# Altium schematic sheet Схема принципиальная3.SchDoc
size 594 x 420 mm; Address1: Address1; Address2: Address2; Address3: Address3; Address4: Address4; SheetNumber: 1; Scale: 1:1; Разраб.: Павловская В.А.; Пров.: Смолин В.А.; Номер листа: 1; Общее количество листов: 1; Наименование изделия 1: Цифровой автомат; Наименование изделия 2: Схема электрическая; Наименование изделия 3: принципиальная; Нач. отд.: Нач. отд.
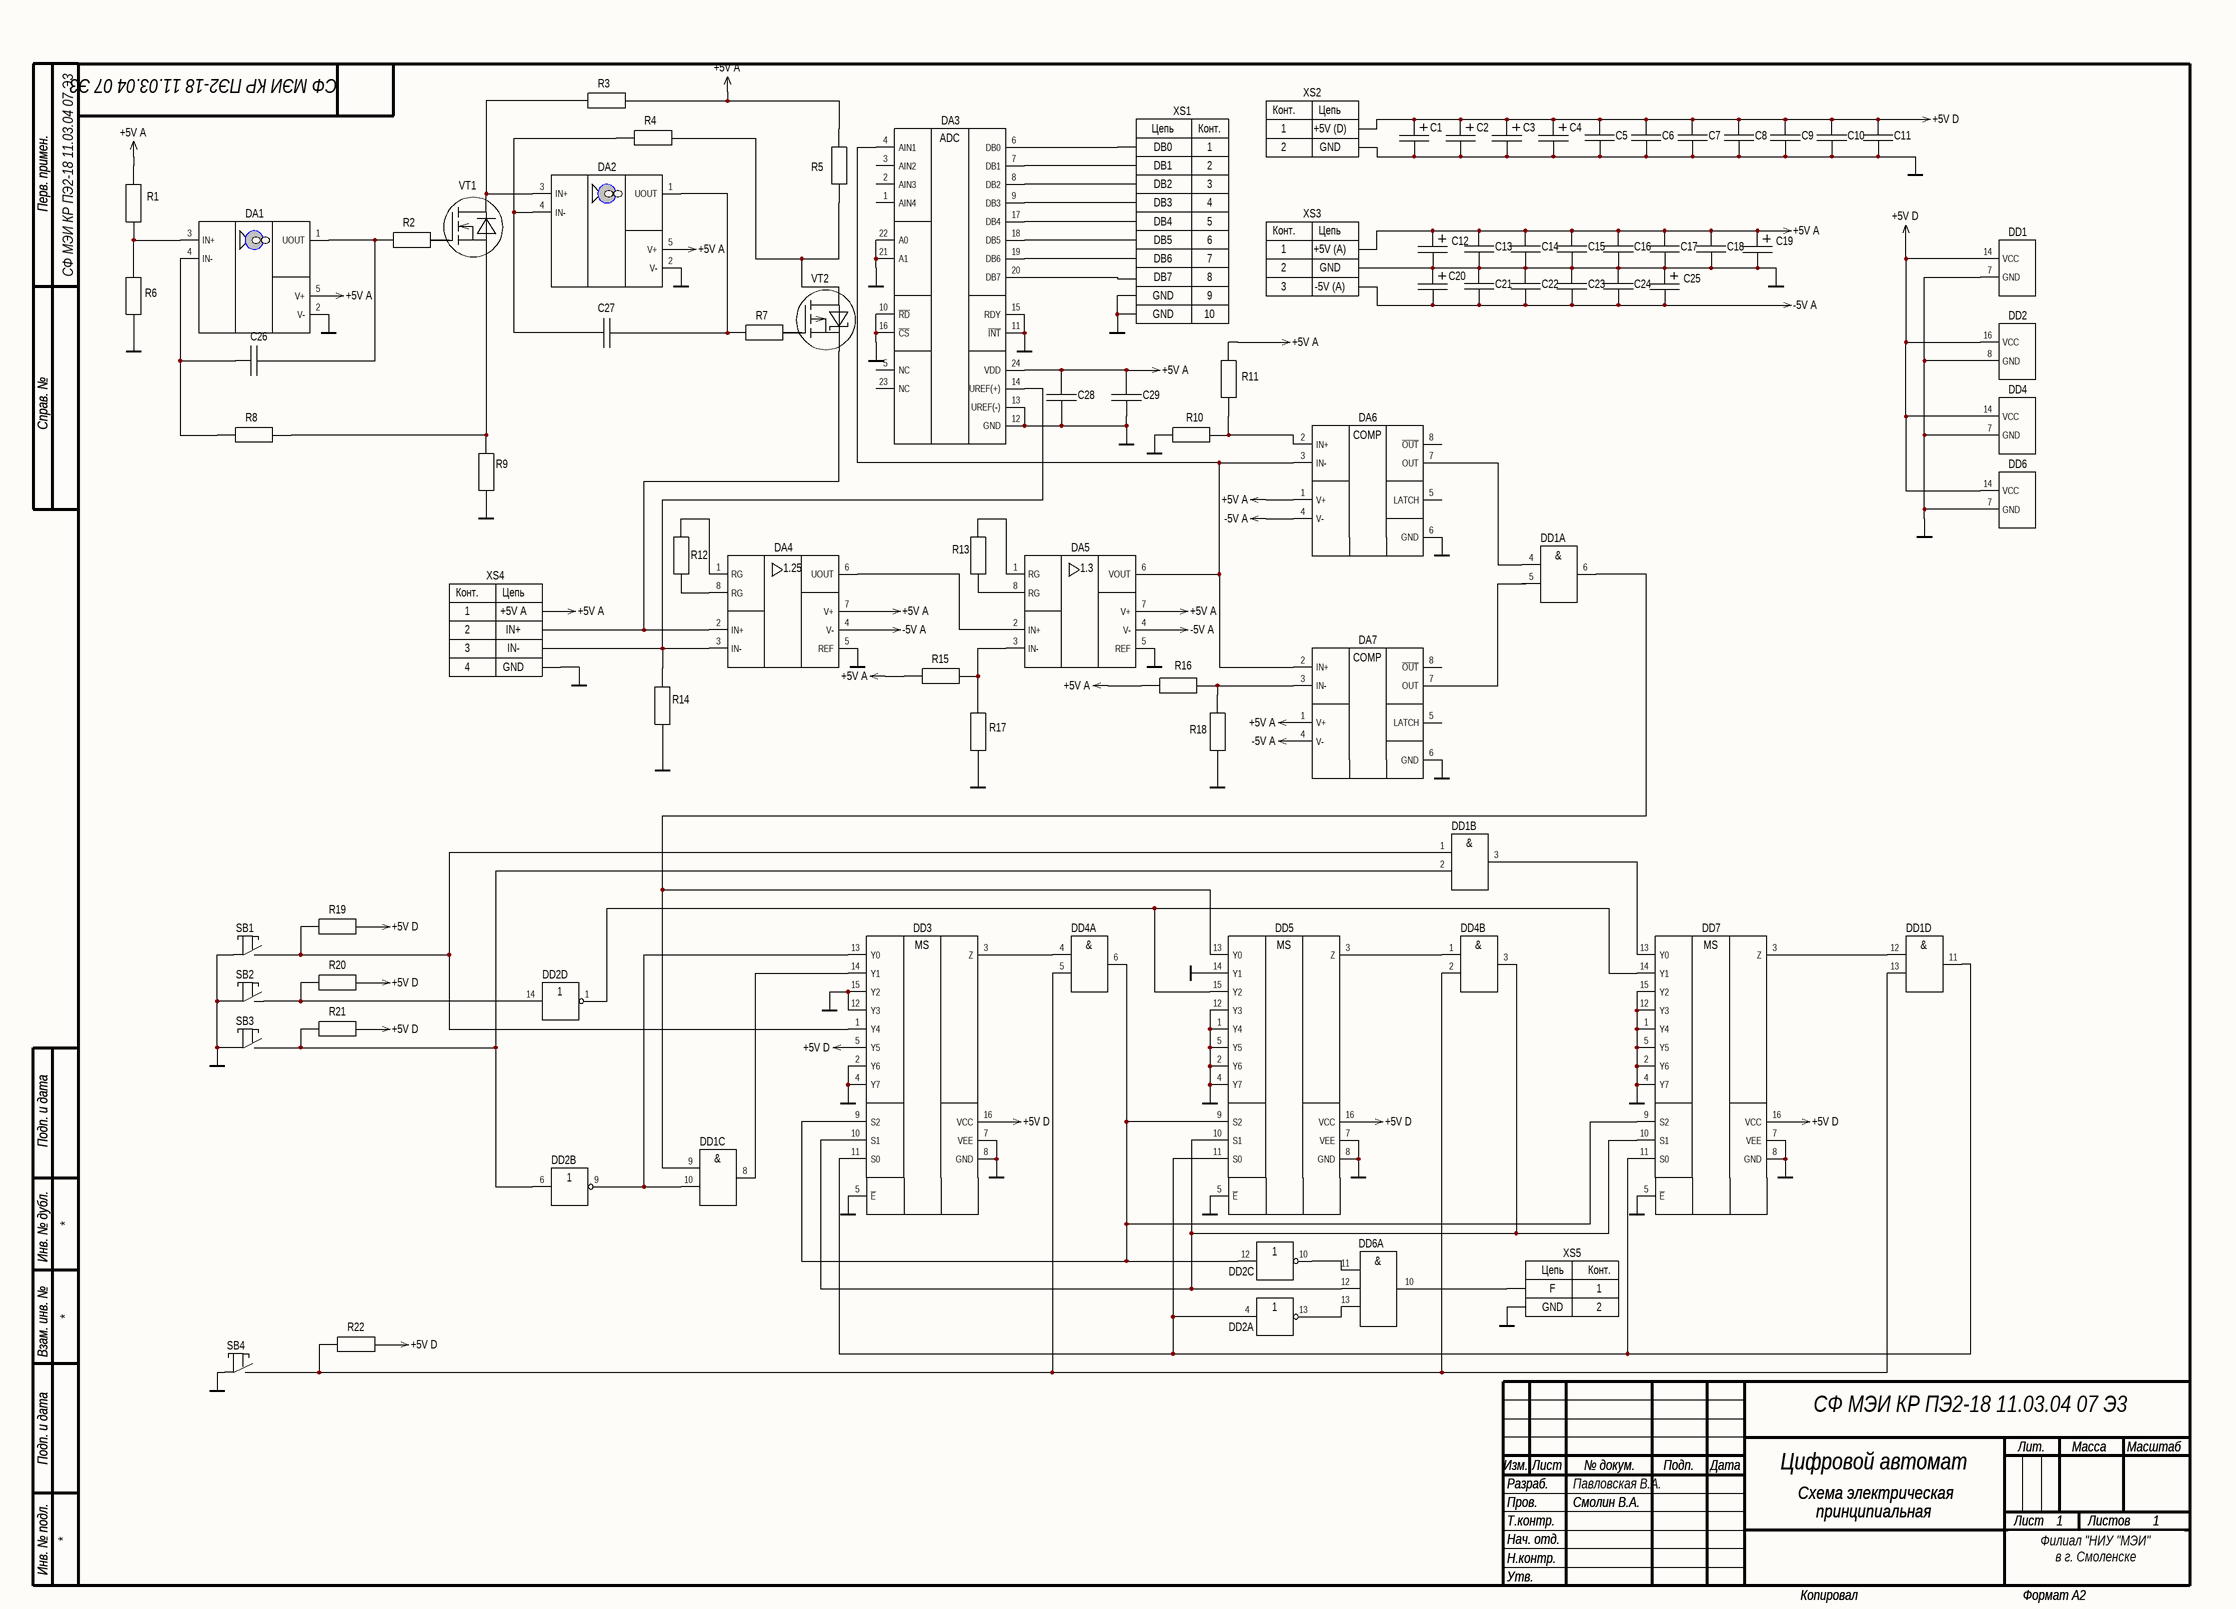
[diagram p0: Схема принципиальная3.SchDoc]

## Parts
C5  0.1uF  [Кер.ЧИП конд. 0.1 мкФ X7R 50В 10% 0805]  (value not drawn)
C6  0.1uF  [Кер.ЧИП конд. 0.1 мкФ X7R 50В 10% 0805]  (value not drawn)
C7  0.1uF  [Кер.ЧИП конд. 0.1 мкФ X7R 50В 10% 0805]  (value not drawn)
C8  0.1uF  [Кер.ЧИП конд. 0.1 мкФ X7R 50В 10% 0805]  (value not drawn)
C9  0.1uF  [Кер.ЧИП конд. 0.1 мкФ X7R 50В 10% 0805]  (value not drawn)
C10  0.1uF  [Кер.ЧИП конд. 0.1 мкФ X7R 50В 10% 0805]  (value not drawn)
C11  0.1uF  [Кер.ЧИП конд. 0.1 мкФ X7R 50В 10% 0805]  (value not drawn)
C13  0.1uF  [Кер.ЧИП конд. 0.1 мкФ X7R 50В 10% 0805]  (value not drawn)
C14  0.1uF  [Кер.ЧИП конд. 0.1 мкФ X7R 50В 10% 0805]  (value not drawn)
C15  0.1uF  [Кер.ЧИП конд. 0.1 мкФ X7R 50В 10% 0805]  (value not drawn)
C16  0.1uF  [Кер.ЧИП конд. 0.1 мкФ X7R 50В 10% 0805]  (value not drawn)
C17  0.1uF  [Кер.ЧИП конд. 0.1 мкФ X7R 50В 10% 0805]  (value not drawn)
C18  0.1uF  [Кер.ЧИП конд. 0.1 мкФ X7R 50В 10% 0805]  (value not drawn)
C21  0.1uF  [Кер.ЧИП конд. 0.1 мкФ X7R 50В 10% 0805]  (value not drawn)
C22  0.1uF  [Кер.ЧИП конд. 0.1 мкФ X7R 50В 10% 0805]  (value not drawn)
C23  0.1uF  [Кер.ЧИП конд. 0.1 мкФ X7R 50В 10% 0805]  (value not drawn)
C24  0.1uF  [Кер.ЧИП конд. 0.1 мкФ X7R 50В 10% 0805]  (value not drawn)
C26  1000pF  [Кер.ЧИП конд. 100пФ NPO 50В 5% 0805, GRM2165C1H101J]  (value not drawn)
C27  2200pF  [Кер.ЧИП конд. 100пФ NPO 50В 5% 0805, GRM2165C1H101J]  (value not drawn)
C28  0.1uF  [Кер.ЧИП конд. 0.1 мкФ X7R 50В 10% 0805]  (value not drawn)
C29  47uF  [Кер.ЧИП конд. 47 мкФ X5R 20% 10В 1206]  (value not drawn)
DA1  DA6  [ОУ для источника тока]  (value not drawn)
DA2  DA7  [ОУ для источника тока]  (value not drawn)
DA4  INA118E_BB  [AD620 Инструмент.усилитель]  (value not drawn)
DA5  INA118E_BB_1  [AD620 Инструмент.усилитель]  (value not drawn)
DA6  AD8561  [AD8561]  (value not drawn)
DA7  AD8561  [AD8561]  (value not drawn)
DA33  AD7824  [AD7824]  (value not drawn)
DD1  И №1 (4 компонента)  [4x2И]  (value not drawn)  (parts A,B,C,D,E of 5)
DD2  НЕ №3 (4 компонента)  [CD4044B]  (value not drawn)  (parts A,B,C,D,E of 5)
DD3  74HC40510  [Мультиплексор]  (value not drawn)
DD4  И №2 (2 компонента)  [4x2И]  (value not drawn)  (parts A,B,C of 3)
DD5  74HC40510  [Мультиплексор]  (value not drawn)
DD6  3И №1  [4x2И]  (value not drawn)  (parts A,B of 2)
DD7  74HC40510  [Мультиплексор]  (value not drawn)
R1  3k  [0.125Вт 0805 3 кОм, 5%, Чип резистор (SMD)]  (value not drawn)
R2  200  [0.125Вт 0805 3 кОм, 5%, Чип резистор (SMD)]  (value not drawn)
R3  470  [0.125Вт 0805 3 кОм, 5%, Чип резистор (SMD)]  (value not drawn)
R4  10k  [0.125Вт 0805 3 кОм, 5%, Чип резистор (SMD)]  (value not drawn)
R5  4.7  [0.125Вт 0805 3 кОм, 5%, Чип резистор (SMD)]  (value not drawn)
R6  2k  [0.125Вт 0805 3 кОм, 5%, Чип резистор (SMD)]  (value not drawn)
R7  330  [0.125Вт 0805 3 кОм, 5%, Чип резистор (SMD)]  (value not drawn)
R8  10k  [0.125Вт 0805 3 кОм, 5%, Чип резистор (SMD)]  (value not drawn)
R9  2k  [0.125Вт 0805 3 кОм, 5%, Чип резистор (SMD)]  (value not drawn)
R10  1.5k  [0.125Вт 0805 15Ом, 5%, Чип резистор (SMD)]  (value not drawn)
R11  8.2k  [0.125Вт 0805 82Ом, 5%, Чип резистор (SMD)]  (value not drawn)
R12  200k  [0.125Вт 0805 200 кОм, 5%, Чип резистор (SMD)]  (value not drawn)
R13  160k  [0.125Вт 0805 160 кОм, 5%, Чип резистор (SMD)]  (value not drawn)
R14  51k  [0.125Вт 0805 51 кОм, 5%, Чип резистор (SMD)]  (value not drawn)
R15  7.5k  [0.125Вт 0805 75Ом, 5%, Чип резистор (SMD)]  (value not drawn)
R16  1k  [0.125Вт 0805 91Ом, 5%, Чип резистор (SMD)]  (value not drawn)
R17  2.2k  [0.125Вт 0805 22Ом, 5%, Чип резистор (SMD)]  (value not drawn)
R18  56  [0.125Вт 0805 5.1Ом, 5%, Чип резистор (SMD)]  (value not drawn)
R19  10k  [0.125Вт 0805 3 кОм, 5%, Чип резистор (SMD)]  (value not drawn)
R20  10k  [0.125Вт 0805 3 кОм, 5%, Чип резистор (SMD)]  (value not drawn)
R21  10k  [0.125Вт 0805 3 кОм, 5%, Чип резистор (SMD)]  (value not drawn)
R22  10k  [0.125Вт 0805 3 кОм, 5%, Чип резистор (SMD)]  (value not drawn)
SB1  Выключатель кнопочный с замыкающим контактом  [Выключатель кнопочный ese21x]  (value not drawn)
SB2  Выключатель кнопочный с замыкающим контактом  [Выключатель кнопочный ese21x]  (value not drawn)
SB3  Выключатель кнопочный с замыкающим контактом  [Выключатель кнопочный ese21x]  (value not drawn)
SB4  Выключатель кнопочный с замыкающим контактом  [Выключатель кнопочный ese21x]  (value not drawn)
VT1  Транзистор N-канальный  [Транзистор N-канальный]  (value not drawn)
VT2  Транзистор р-канальный  [Транзистор р-канальный]  (value not drawn)
XS1  XS 10Pin  [CI1108M1H]  (value not drawn)
XS2  XS 2Pin (D)  [CI1102M1H  (F)]  (value not drawn)
XS3  XS 3Pin (A)  [CI1108M1H - duplicate]  (value not drawn)
XS4  XS Датчик  [CI1102M1H]  (value not drawn)
XS5  XS 2Pin_1  [CI1102M1H  (F)]  (value not drawn)
С1  1uF  [ECAP SMD, 1 мкФ, 50В, Конденсатор электролитический алюминиевый SMD]  (value not drawn)
С2  1uF  [ECAP SMD, 1 мкФ, 50В, Конденсатор электролитический алюминиевый SMD]  (value not drawn)
С3  1uF  [ECAP SMD, 1 мкФ, 50В, Конденсатор электролитический алюминиевый SMD]  (value not drawn)
С4  1uF  [ECAP SMD, 1 мкФ, 50В, Конденсатор электролитический алюминиевый SMD]  (value not drawn)
С12  1uF  [ECAP SMD, 1 мкФ, 50В, Конденсатор электролитический алюминиевый SMD]  (value not drawn)
С19  1uF  [ECAP SMD, 1 мкФ, 50В, Конденсатор электролитический алюминиевый SMD]  (value not drawn)
С20  1uF  [ECAP SMD, 1 мкФ, 50В, Конденсатор электролитический алюминиевый SMD]  (value not drawn)
С25  1uF  [ECAP SMD, 1 мкФ, 50В, Конденсатор электролитический алюминиевый SMD]  (value not drawn)

## Nets
+5V A: C13.2 C14.2 C15.2 C16.2 C17.2 C18.2 C28.2 C29.2 DA1.5(V+) DA2.5(V+) DA4.7(V+) DA5.7(V+) DA6.1(V+) DA7.1(V+) DA33.24(VDD) R1.1 R3.2 R5.2 R11.2 R15.1 R16.1 XS3.1(Pin1) XS4.1(Pin1) С12.1 С19.1
+5V D: C5.2 C6.2 C7.2 C8.2 C9.2 C10.2 C11.2 DD1.14(VCC) DD2.16(VCC) DD3.5(Y5) DD3.16(VCC) DD4.14(VCC) DD5.16(VCC) DD6.14(VCC) DD7.16(VCC) R19.2 R20.2 R21.2 R22.2 XS2.1(Pin1) С1.1 С2.1 С3.1 С4.1
-5V A: C21.1 C22.1 C23.1 C24.1 DA4.4(V-) DA5.4(V-) DA6.4(V-) DA7.4(V-) XS3.3(Pin3) С20.2 С25.2
GND A: C13.1 C14.1 C15.1 C16.1 C17.1 C18.1 C21.2 C22.2 C23.2 C24.2 C28.1 C29.1 DA1.2(V-) DA2.2(V-) DA4.5(REF) DA5.5(REF) DA6.6(GND) DA7.6(GND) DA33.10(~{RD}) DA33.11(~{INT}) DA33.12(GND) DA33.13(UREF(-)) DA33.15(RDY) DA33.16(~{CS}) DA33.21(A1) DA33.22(A0) R6.2 R9.1 R10.1 R14.2 R17.1 R18.1 XS1.9(Pin9) XS1.10(Pin10) XS3.2(Pin2) XS4.4 С12.2 С19.2 С20.1 С25.1
GND D: C5.1 C6.1 C7.1 C8.1 C9.1 C10.1 C11.1 DD1.7(GND) DD2.8(GND) DD3.2(Y6) DD3.4(Y7) DD3.5(~{E}) DD3.7(VEE) DD3.8(GND) DD3.12(Y3) DD3.15(Y2) DD4.7(GND) DD5.1(Y4) DD5.2(Y6) DD5.4(Y7) DD5.5(~{E}) DD5.7(VEE) DD5.8(GND) DD5.12(Y3) DD5.14(Y1) DD6.7(GND) DD7.1(Y4) DD7.2(Y6) DD7.4(Y7) DD7.5(~{E}) DD7.7(VEE) DD7.8(GND) DD7.12(Y3) DD7.15(Y2) SB1.1 SB2.1 SB3.1 SB4.1 XS2.2(Pin2) XS5.2(Pin2) С1.2 С2.2 С3.2 С4.2
NetC26_1: C26.1 DA1.4(IN-) R8.1
NetC26_2: C26.2 DA1.1(UOUT) R2.1
NetC27_1: C27.1 DA2.4(IN-) R4.1
NetC27_2: C27.2 DA2.1(UOUT) R7.1
NetDA1_3: DA1.3(IN+) R1.2 R6.1
NetDA2_3: DA2.3(IN+) R3.1 VT1.3(D)
NetDA4_1: DA4.1(RG) R12.2
NetDA4_2: DA4.2(IN+) VT2.3(S) XS4.2(Pin2)
NetDA4_3: DA4.3(IN-) DA33.14(UREF(+)) R14.1 XS4.3
NetDA4_6: DA4.6(UOUT) DA5.2(IN+)
NetDA4_8: DA4.8(RG) R12.1
NetDA5_1: DA5.1(RG) R13.2
NetDA5_3: DA5.3(IN-) R15.2 R17.2
NetDA5_6: DA5.6(VOUT) DA6.3(IN-) DA7.2(IN+) DA33.4(AIN1)
NetDA5_8: DA5.8(RG) R13.1
NetDA6_2: DA6.2(IN+) R10.2 R11.1
NetDA6_7: DA6.7(OUT) DD1.4
NetDA7_3: DA7.3(IN-) R16.2 R18.2
NetDA7_7: DA7.7(OUT) DD1.5
NetDA33_6: DA33.6(DB0) XS1.1(Pin1)
NetDA33_7: DA33.7(DB1) XS1.2(Pin2)
NetDA33_8: DA33.8(DB2) XS1.3(Pin3)
NetDA33_9: DA33.9(DB3) XS1.4(Pin4)
NetDA33_17: DA33.17(DB4) XS1.5(Pin5)
NetDA33_18: DA33.18(DB5) XS1.6(Pin6)
NetDA33_19: DA33.19(DB6) XS1.7(Pin7)
NetDA33_20: DA33.20(DB7) XS1.8(Pin8)
NetDD1_1: DD1.1 DD3.1(Y4) R19.1 SB1.2
NetDD1_2: DD1.2 DD2.6 R21.1 SB3.2
NetDD1_3: DD1.3 DD7.13(Y0)
NetDD1_6: DD1.6 DD1.9 DD5.13(Y0)
NetDD1_8: DD1.8 DD3.14(Y1)
NetDD1_10: DD1.10 DD2.9 DD3.13(Y0)
NetDD1_11: DD1.11 DD2.4 DD3.11(S0) DD5.11(S0) DD7.11(S0)
NetDD1_12: DD1.12 DD7.3(Z)
NetDD1_13: DD1.13 DD4.2 DD4.5 R22.1 SB4.2
NetDD2_1: DD2.1 DD5.15(Y2) DD7.14(Y1)
NetDD2_10: DD2.10 DD6.11
NetDD2_12: DD2.12 DD3.9(S2) DD4.6 DD5.9(S2) DD7.9(S2)
NetDD2_13: DD2.13 DD6.13
NetDD2_14: DD2.14 R20.1 SB2.2
NetDD3_3: DD3.3(Z) DD4.4
NetDD3_10: DD3.10(S1) DD4.3 DD5.10(S1) DD6.12 DD7.10(S1)
NetDD4_1: DD4.1 DD5.3(Z)
NetDD6_10: DD6.10 XS5.1(Pin1)
NetR2_2: R2.2 VT1.1(G)
NetR4_2: R4.2 R5.1 VT2.2(D)
NetR8_2: R8.2 R9.2 VT1.2(S)

Not connected (* = marked no-connect by the designer): DA6 5(LATCH) 8(~{OUT}); DA7 5(LATCH) 8(~{OUT}); DA33 1(AIN4) 2(AIN3) 3(AIN2) 5(NC) 23(NC); R7 2; VT2 1(G)

## Notes on the sheet
- СФ МЭИ КР ПЭ2-18 11.03.04 07 Э3
- (near DA33) DA3
- Перв. примен.
- (near DD1) DD1
- (near DD2) DD2
- DD4
- Справ. №
- DD6
- Подп. и дата
- Инв. № дубл.
- Взам. инв. №
- Разраб.
- Изм.
- Лист
- № докум.
- Подп.
- Дата
- Лит.
- Масса
- Масштаб
- Пров.
- Т.контр.
- Листов
- Инв. № подл.
- Утв.
- Н.контр.
- Филиал "НИУ "МЭИ"
  в г. Смоленске
  ПЭ2-18
- Копировал
- Формат А2
- (in symbol 3И №1, part A) &
- (in symbol AD7824) ADC
- (in symbol AD8561) COMP
- (in symbol INA118E_BB) 1.25
- (in symbol INA118E_BB_1) 1.3
- (in symbol XS 2Pin (D)) Конт.; Цепь; +5V (D); GND
- (in symbol XS 2Pin_1) Цепь; Конт.; F; GND
- (in symbol XS 3Pin (A)) Конт.; Цепь; +5V (A); GND; -5V (A)
- (in symbol XS 10Pin) Цепь; Конт.; DB0; DB1; DB2; DB3; DB4; DB5; DB6; DB7; GND
- (in symbol XS Датчик) Конт.; Цепь; +5V A; IN+; IN-; GND
- (in symbol И №1 (4 компонента), part A) &
- (in symbol И №1 (4 компонента), part B) &
- (in symbol И №1 (4 компонента), part C) &
- (in symbol И №1 (4 компонента), part D) &
- (in symbol И №2 (2 компонента), part A) &
- (in symbol И №2 (2 компонента), part B) &
- (in symbol Мультиплексор) MS

## Library data of the parts
C5-C11 C13-C18 C21-C24 C28 = Кер.ЧИП конд. 0.1 мкФ X7R 50В 10% 0805
C26 C27 = Кер.ЧИП конд. 100пФ NPO 50В 5% 0805, GRM2165C1H101J
C29 = Кер.ЧИП конд. 47 мкФ X5R 20% 10В 1206
DA1 DA2 = OPAx333 1.8-V, microPower, CMOS Operational Amplifiers, Zero-Drift Series: ОУ
DD3 DD5 DD7 = Мультиплексор
R1-R9 R19-R22 = 0.125Вт 0805 5кОм, 5%, Чип резистор (SMD)
R10 = 0.125Вт 0805 15Ом, 5%, Чип резистор (SMD)_2_1: 0.125Вт 0805 15Ом, 5%, Чип резистор (SMD)
R11 = 0.125Вт 0805 82Ом, 5%, Чип резистор (SMD)_2_2: 0.125Вт 0805 82Ом, 5%, Чип резистор (SMD)
R12 = 0.125Вт 0805 200 кОм, 5%, Чип резистор (SMD)
R13 = 0.125Вт 0805 160 кОм, 5%, Чип резистор (SMD)
R14 = 0.125Вт 0805 51 кОм, 5%, Чип резистор (SMD)
R15 = 0.125Вт 0805 75Ом, 5%, Чип резистор (SMD)
R16 = 0.125Вт 0805 91кОм, 5%, Чип резистор (SMD)_1: 0.125Вт 0805 91Ом, 5%, Чип резистор (SMD)
R17 = 0.125Вт 0805 22Ом, 5%, Чип резистор (SMD)
R18 = 0.125Вт 0805 5.1Ом, 5%, Чип резистор (SMD)_2: 0.125Вт 0805 5.1Ом, 5%, Чип резистор (SMD)
VT1 = Транзистор N-канальный: SI2304DDS-T1-GE3
VT2 = Транзистор р-канальный: NTF2955T1G, МОП-транзистор, P Канал, 2.6 А, -60 В, 0.17 Ом, 20 В, -4 В
С1-С4 С12 С19 С20 С25 = ECAP SMD, 1 мкФ, 50В, Конденсатор электролитический алюминиевый SMD